# Altium schematic sheet SML-230109PCB1__MCU.SchDoc
size A4; DocumentNumber: 3; SheetNumber: 3; SheetTotal: 6
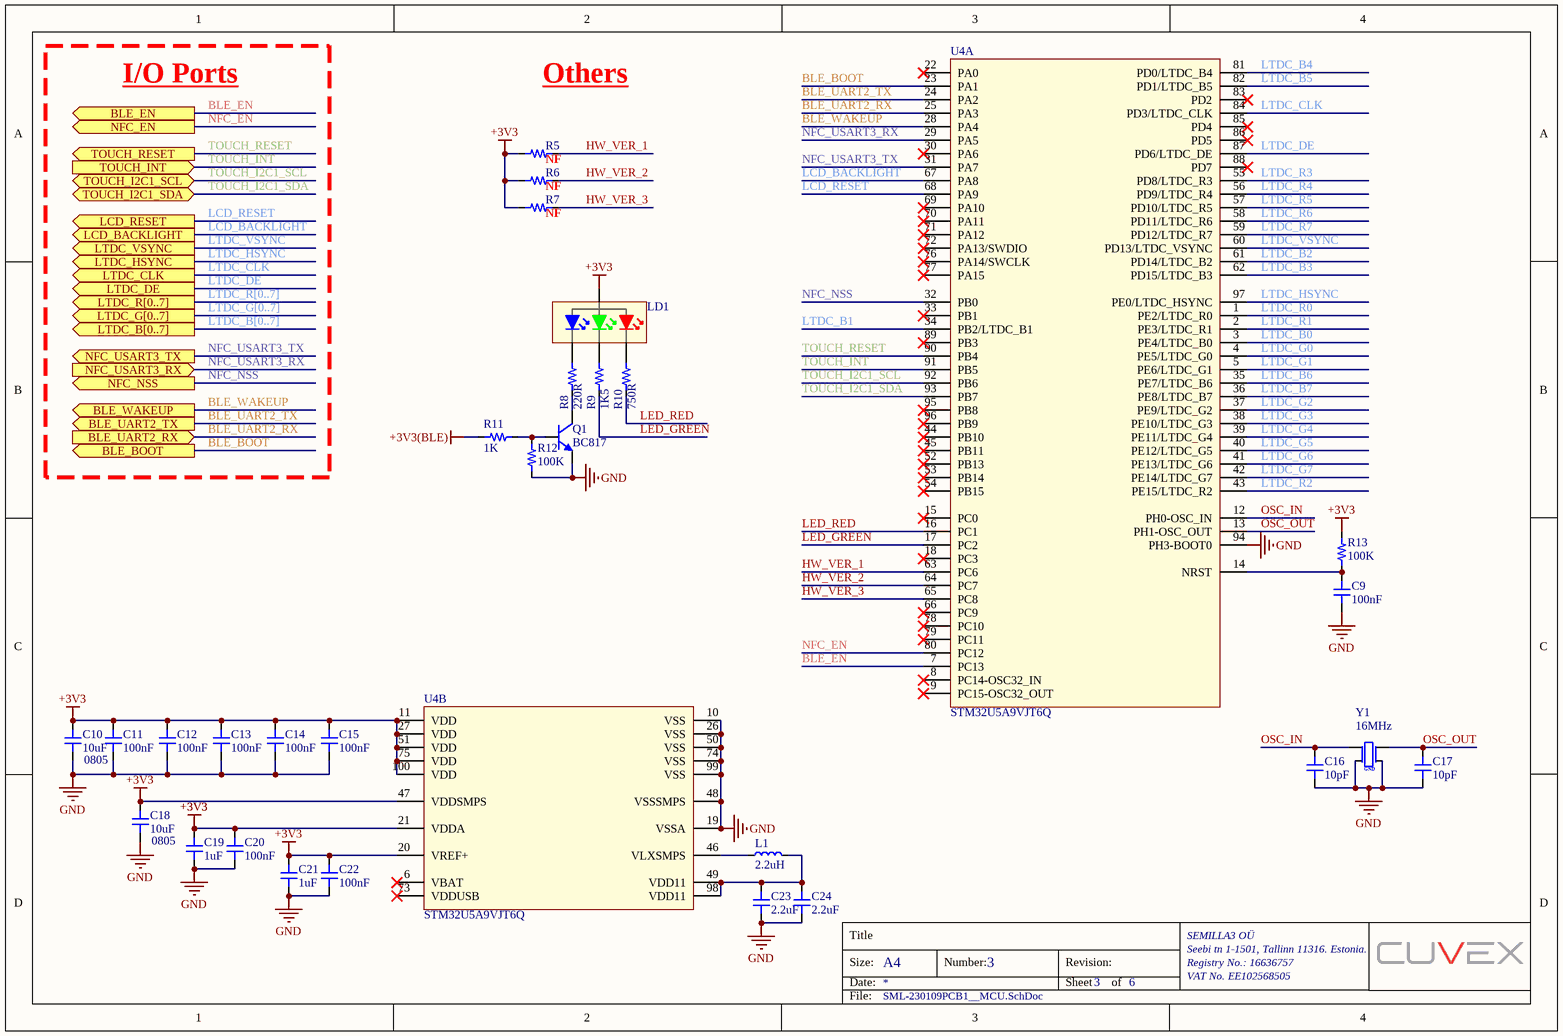
[diagram p0: SML-230109PCB1__MCU.SchDoc]

## Parts
C9  value 100nF  [[G] CAP-MLCC__0603]  (hidden comment: .)
C10  value 10uF  [06] - Package: 0805  [[G] CAP-MLCC__0805]  (hidden comment: .)
C11  value 100nF  [[G] CAP-MLCC__0603]  (hidden comment: .)
C12  value 100nF  [[G] CAP-MLCC__0603]  (hidden comment: .)
C13  value 100nF  [[G] CAP-MLCC__0603]  (hidden comment: .)
C14  value 100nF  [[G] CAP-MLCC__0603]  (hidden comment: .)
C15  value 100nF  [[G] CAP-MLCC__0603]  (hidden comment: .)
C16  value 10pF  [[G] CAP-MLCC__0603]  (hidden comment: .)
C17  value 10pF  [[G] CAP-MLCC__0603]  (hidden comment: .)
C18  value 10uF  [06] - Package: 0805  [[G] CAP-MLCC__0805]  (hidden comment: .)
C19  value 1uF  [[G] CAP-MLCC__0603]  (hidden comment: .)
C20  value 100nF  [[G] CAP-MLCC__0603]  (hidden comment: .)
C21  value 1uF  [[G] CAP-MLCC__0603]  (hidden comment: .)
C22  value 100nF  [[G] CAP-MLCC__0603]  (hidden comment: .)
C23  value 2.2uF  [[G] CAP-MLCC__0603]  (hidden comment: .)
C24  value 2.2uF  [[G] CAP-MLCC__0603]  (hidden comment: .)
L1  value 2.2uH  [[G] IND__0603]  (hidden comment: .)
LD1  .  [LED__0603-RGB__APHF1608]  (value not drawn)
Q1  .  [[G] SOT23-3]  (value not drawn)
R5  .  [[G] RES-CHIP__0603]  (value not drawn)
R6  .  [[G] RES-CHIP__0603]  (value not drawn)
R7  .  [[G] RES-CHIP__0603]  (value not drawn)
R8  value 220R  [[G] RES-CHIP__0603]  (hidden comment: .)
R9  value 1K5  [[G] RES-CHIP__0603]  (hidden comment: .)
R10  value 750R  [[G] RES-CHIP__0603]  (hidden comment: .)
R11  value 1K  [[G] RES-CHIP__0603]  (hidden comment: .)
R12  value 100K  [[G] RES-CHIP__0603]  (hidden comment: .)
R13  value 100K  [[G] RES-CHIP__0603]  (hidden comment: .)
U4  .  [[G] LQFP-100 (14X14MM)]  (value not drawn)  (parts A,B of 2)
Y1  value 16MHz  [CRYSTAL__ABM8G]  (hidden comment: .)

## Ports
BLE_BOOT (out, see 6[3C]), BLE_EN (out, see 2[1C]), BLE_UART2_RX (in, see 6[2A]), BLE_UART2_TX (out, see 6[2A]), BLE_WAKEUP (out, see 6[2A]), LCD_BACKLIGHT (out, see 4[3C]), LCD_RESET (out, see 4[1A]), LTDC_B[0..7] (out, see 4[1B]), LTDC_CLK (out, see 4[1C]), LTDC_DE (out, see 4[1D]), LTDC_G[0..7] (out, see 4[1B]), LTDC_HSYNC (out, see 4[1C]), LTDC_R[0..7] (out, see 4[1B]), LTDC_VSYNC (out, see 4[1C]), NFC_EN (out, see 2[3C]), NFC_NSS (out, see 5[2B]), NFC_USART3_RX (in, see 5[2B]), NFC_USART3_TX (out, see 5[2B]), TOUCH_I2C1_SCL (bidir, see 4[3A]), TOUCH_I2C1_SDA (bidir, see 4[3A]), TOUCH_INT (in, see 4[3B]), TOUCH_RESET (out, see 4[3A])

## Nets
+3V3: C10.2 C11.2 C12.2 C13.2 C14.2 C15.2 C18.2 C19.1 C20.1 C21.1 C22.1 LD1.A R5.1 R6.1 R7.1 R13.1 U4.11(VDD) U4.20(VREF+) U4.21(VDDA) U4.27(VDD) U4.47(VDDSMPS) U4.51(VDD) U4.75(VDD) U4.100(VDD)
+3V3(BLE): R11.2
GND: C9.2 C10.1 C11.1 C12.1 C13.1 C14.1 C15.1 C16.1 C17.1 C18.1 C19.2 C20.2 C21.2 C22.2 C23.1 C24.1 Q1.2(E) R12.1 U4.10(VSS) U4.19(VSSA) U4.26(VSS) U4.48(VSSSMPS) U4.50(VSS) U4.74(VSS) U4.94(PH3-BOOT0) U4.99(VSS) Y1.2(gnd) Y1.4(gnd)
BLE_BOOT: U4.23(PA1) ; port BLE_BOOT
BLE_EN: U4.7(PC13) ; port BLE_EN
BLE_UART2_RX: U4.25(PA3) ; port BLE_UART2_RX
BLE_UART2_TX: U4.24(PA2) ; port BLE_UART2_TX
BLE_WAKEUP: U4.28(PA4) ; port BLE_WAKEUP
HW_VER_1: R5.2 U4.63(PC6)
HW_VER_2: R6.2 U4.64(PC7)
HW_VER_3: R7.2 U4.65(PC8)
LCD_BACKLIGHT: U4.67(PA8) ; port LCD_BACKLIGHT
LCD_RESET: U4.68(PA9) ; port LCD_RESET
LED_GREEN: R9.2 U4.17(PC2)
LED_RED: R10.2 U4.16(PC1)
LTDC_B0: U4.3(PE4/LTDC_B0)
LTDC_B1: U4.34(PB2/LTDC_B1)
LTDC_B2: U4.61(PD14/LTDC_B2)
LTDC_B3: U4.62(PD15/LTDC_B3)
LTDC_B4: U4.81(PD0/LTDC_B4)
LTDC_B5: U4.82(PD1/LTDC_B5)
LTDC_B6: U4.35(PE7/LTDC_B6)
LTDC_B7: U4.36(PE8/LTDC_B7)
LTDC_CLK: U4.84(PD3/LTDC_CLK) ; port LTDC_CLK
LTDC_DE: U4.87(PD6/LTDC_DE) ; port LTDC_DE
LTDC_G0: U4.4(PE5/LTDC_G0)
LTDC_G1: U4.5(PE6/LTDC_G1)
LTDC_G2: U4.37(PE9/LTDC_G2)
LTDC_G3: U4.38(PE10/LTDC_G3)
LTDC_G4: U4.39(PE11/LTDC_G4)
LTDC_G5: U4.40(PE12/LTDC_G5)
LTDC_G6: U4.41(PE13/LTDC_G6)
LTDC_G7: U4.42(PE14/LTDC_G7)
LTDC_HSYNC: U4.97(PE0/LTDC_HSYNC) ; port LTDC_HSYNC
LTDC_R0: U4.1(PE2/LTDC_R0)
LTDC_R1: U4.2(PE3/LTDC_R1)
LTDC_R2: U4.43(PE15/LTDC_R2)
LTDC_R3: U4.55(PD8/LTDC_R3)
LTDC_R4: U4.56(PD9/LTDC_R4)
LTDC_R5: U4.57(PD10/LTDC_R5)
LTDC_R6: U4.58(PD11/LTDC_R6)
LTDC_R7: U4.59(PD12/LTDC_R7)
LTDC_VSYNC: U4.60(PD13/LTDC_VSYNC) ; port LTDC_VSYNC
NFC_EN: U4.80(PC12) ; port NFC_EN
NFC_NSS: U4.32(PB0) ; port NFC_NSS
NFC_USART3_RX: U4.29(PA5) ; port NFC_USART3_RX
NFC_USART3_TX: U4.31(PA7) ; port NFC_USART3_TX
OSC_IN: C16.2 U4.12(PH0-OSC_IN) Y1.1(OSC1)
OSC_OUT: C17.2 U4.13(PH1-OSC_OUT) Y1.3(OSC2)
TOUCH_I2C1_SCL: U4.92(PB6) ; port TOUCH_I2C1_SCL
TOUCH_I2C1_SDA: U4.93(PB7) ; port TOUCH_I2C1_SDA
TOUCH_INT: U4.91(PB5) ; port TOUCH_INT
TOUCH_RESET: U4.90(PB4) ; port TOUCH_RESET
NetC9_1: C9.1 R13.2 U4.14(NRST)
NetC23_2: C23.2 C24.2 L1.2 U4.49(VDD11) U4.98(VDD11)
NetL1_1: L1.1 U4.46(VLXSMPS)
NetLD1_KB: LD1.KB R8.2
NetLD1_KG: LD1.KG R9.1
NetLD1_KR: LD1.KR R10.1
NetQ1_1: Q1.1(B) R11.1 R12.2
NetQ1_3: Q1.3(C) R8.1

Not connected (* = marked no-connect by the designer): U4 6(VBAT)* 8(PC14-OSC32_IN)* 9(PC15-OSC32_OUT)* 15(PC0)* 18(PC3)* 22(PA0)* 30(PA6)* 33(PB1)* 44(PB10)* 45(PB11)* 52(PB13)* 53(PB14)* 54(PB15)* 66(PC9)* 69(PA10)* 70(PA11)* 71(PA12)* 72(PA13/SWDIO)* 73(VDDUSB)* 76(PA14/SWCLK)* 77(PA15)* 78(PC10)* 79(PC11)* 83(PD2)* 85(PD4)* 86(PD5)* 88(PD7)* 89(PB3)* 95(PB8)* 96(PB9)*

## Buses and harness runs
bus LTDC_B[0..7] = port LTDC_B[0..7]
bus LTDC_G[0..7] = port LTDC_G[0..7]
bus LTDC_R[0..7] = port LTDC_R[0..7]

## Notes on the sheet
- I/O Ports
- Others
- (near R5) NF
- (near R6) NF
- (near R7) NF
- Title
- Size:
- Date:
- A4
- Number:
- Revision:
- Sheet
- of
- SEMILLA3 OÜ
- Seebi tn 1-1501, Tallinn 11316. Estonia.
- Registry No.: 16636757
- VAT No. EE102568505
- File:
- (in symbol ABM8G-16.000MHZ-4Y-T3) GND

## Library data of the parts
C9 C11-C15 C20 C22 = CAP_MLCC_0603: CAP MLCC 0603; [00] - Description (BOM): CAP MLCC 100nF 0603 010; [04] - Power features: 010; STAR Code: C100nF0603010; [06] - Package: 0603; [01] - MPN Code: *; [02] - Manufacturer: *; [03] - Datasheet: *; [05] - Temperature range: *; [07] - PVP Dealer name: *; [08] - PVP 1K: *; Voltage: 010
C10 C18 = CAP_MLCC_0805: CAP MLCC 0805; [00] - Description (BOM): CAP MLCC 10uF 0805 010; [04] - Power features: 010; STAR Code: C10uF0805010; [01] - MPN Code: *; [02] - Manufacturer: *; [03] - Datasheet: *; [05] - Temperature range: *; [07] - PVP Dealer name: *; [08] - PVP 1K: *; Voltage: 010
C16 C17 = CAP_MLCC_0603: CAP MLCC 0603; [00] - Description (BOM): CAP MLCC 10pF 0603 010; [04] - Power features: 010; STAR Code: C10pF0603010; [06] - Package: 0603; [01] - MPN Code: *; [02] - Manufacturer: *; [03] - Datasheet: *; [05] - Temperature range: *; [07] - PVP Dealer name: *; [08] - PVP 1K: *; Voltage: 010
C19 C21 = CAP_MLCC_0603: CAP MLCC 0603; [00] - Description (BOM): CAP MLCC 1uF 0603 010; [04] - Power features: 010; STAR Code: C1uF0603010; [06] - Package: 0603; [01] - MPN Code: *; [02] - Manufacturer: *; [03] - Datasheet: *; [05] - Temperature range: *; [07] - PVP Dealer name: *; [08] - PVP 1K: *; Voltage: 010
C23 C24 = CAP_MLCC_0603: CAP MLCC 0603; [00] - Description (BOM): CAP MLCC 2.2uF 0603 010; [04] - Power features: 010; STAR Code: C2.2uF0603010; [06] - Package: 0603; [01] - MPN Code: *; [02] - Manufacturer: *; [03] - Datasheet: *; [05] - Temperature range: *; [07] - PVP Dealer name: *; [08] - PVP 1K: *; Voltage: 010
L1 = IND_SMD_0603: IND SMD 0603 [G]; [01] - MPN Code: LQM18FN2R2M00D; [00] - Description (BOM): IND 2.2uH 0603; [06] - Package: 0603; [02] - Manufacturer: *; [03] - Datasheet: *; [04] - Power features: *; [05] - Temperature range: *; [07] - PVP Dealer name: *; [08] - PVP 1K: *; STAR Code: *
LD1 = APHF1608LSEEQBDZGKC: LED 0603, RGB (621/525/465nm), If=2mA, Vf=1'8-2'65V; [02] - Manufacturer: Kingbright; [05] - Temperature range: -40 to+85 ºC; [06] - Package: 0603; [00] - Description (BOM): LED 0603, RGB (621/525/465nm), If=2mA, Vf=1'8-2'65V; [03] - Datasheet: https://www.mouser.es/datasheet/2/216/APHF1608LSEEQBDZGKC-1145215.pdf; [04] - Power features: If=2mA, Vf=1'8-2'65V; [07] - PVP Dealer name: *; [08] - PVP 1K: *; STAR Code: *; [01] - MPN Code: APHF1608LSEEQBDZGKC
Q1 = BC817: TRANS BIPOLAR NPN, SOT23-3 [G]; [00] - Description (BOM): TRANS BIPOLAR NPN, SOT23-3 [G]; [02] - Manufacturer: *; [03] - Datasheet: *; [04] - Power features: *; [05] - Temperature range: *; [06] - Package: SOT23-3; [07] - PVP Dealer name: *; [08] - PVP 1K: *; [01] - MPN Code: *; STAR Code: BC817
R5-R7 = RES_SMD_0603: RES SMD 0603 [G]; [00] - Description (BOM): RES * OHM 0603 1% 1/10W; [04] - Power features: 100mW; STAR Code: *06031%; Tolerance: 1%; [06] - Package: 0603; [01] - MPN Code: *; [02] - Manufacturer: *; [03] - Datasheet: *; [05] - Temperature range: *; [07] - PVP Dealer name: *; [08] - PVP 1K: *; Value: *
R8 = RES_SMD_0603: RES SMD 0603 [G]; [00] - Description (BOM): RES 220R OHM 0603 1% 1/10W; [04] - Power features: 100mW; STAR Code: 220R06031%; Tolerance: 1%; [06] - Package: 0603; [01] - MPN Code: *; [02] - Manufacturer: *; [03] - Datasheet: *; [05] - Temperature range: *; [07] - PVP Dealer name: *; [08] - PVP 1K: *
R9 = RES_SMD_0603: RES SMD 0603 [G]; [00] - Description (BOM): RES 1K5 OHM 0603 1% 1/10W; [04] - Power features: 100mW; STAR Code: 1K506031%; Tolerance: 1%; [06] - Package: 0603; [01] - MPN Code: *; [02] - Manufacturer: *; [03] - Datasheet: *; [05] - Temperature range: *; [07] - PVP Dealer name: *; [08] - PVP 1K: *
R10 = RES_SMD_0603: RES SMD 0603 [G]; [00] - Description (BOM): RES 750R OHM 0603 1% 1/10W; [04] - Power features: 100mW; STAR Code: 750R06031%; Tolerance: 1%; [06] - Package: 0603; [01] - MPN Code: *; [02] - Manufacturer: *; [03] - Datasheet: *; [05] - Temperature range: *; [07] - PVP Dealer name: *; [08] - PVP 1K: *
R11 = RES_SMD_0603: RES SMD 0603 [G]; [00] - Description (BOM): RES 1K OHM 0603 1% 1/10W; [04] - Power features: 100mW; STAR Code: 1K06031%; Tolerance: 1%; [06] - Package: 0603; [01] - MPN Code: *; [02] - Manufacturer: *; [03] - Datasheet: *; [05] - Temperature range: *; [07] - PVP Dealer name: *; [08] - PVP 1K: *
R12 R13 = RES_SMD_0603: RES SMD 0603 [G]; [00] - Description (BOM): RES 100K OHM 0603 1% 1/10W; [04] - Power features: 100mW; STAR Code: 100K06031%; Tolerance: 1%; [06] - Package: 0603; [01] - MPN Code: *; [02] - Manufacturer: *; [03] - Datasheet: *; [05] - Temperature range: *; [07] - PVP Dealer name: *; [08] - PVP 1K: *
U4 = STM32U5A9VJT6Q: MCU ARM 32bit, Cortex-M33 (160MHz), 4MB/2'5MB, LQFP-100 (14x14), SMPS, TrustZone, LTDC, crypto; [02] - Manufacturer: STMicroelectronics; [04] - Power features: Vin=1'71-3'6V; [05] - Temperature range: -40 to +85 ºC; [00] - Description (BOM): MCU ARM 32bit, Cortex-M33 (160MHz), 4MB/2'5MB, LQFP-100 (14x14), SMPS, TrustZone, LTDC, crypto; [03] - Datasheet: https://www.st.com/resource/en/datasheet/stm32u5a9vj.pdf; [06] - Package: LQFP-100 (14x14); [07] - PVP Dealer name: *; [08] - PVP 1K: *; STAR Code: *; [01] - MPN Code: STM32U5A9VJT6Q
Y1 = ABM8G-16.000MHZ-4Y-T3: CRYSTAL, 16.0000MHz, ±30ppm, CL=10pF, CS=5pF; [02] - Manufacturer: Abracon LLC; [05] - Temperature range: -10 to +60 ºC; [06] - Package: ABM8G (3.2 x 2.5mm); [00] - Description (BOM): CRYSTAL, 16.0000MHz, ±30ppm, CL=10pF, CS=5pF; [03] - Datasheet: https://www.mouser.es/datasheet/2/3/ABM8G-1608872.pdf; [04] - Power features: *; [07] - PVP Dealer name: *; [08] - PVP 1K: *; STAR Code: *; [01] - MPN Code: ABM8G-16.000MHZ-4Y-T3